# Altium schematic sheet 11_Power.SchDoc: Power (part 1 of 2)
size A3; Organization: Lime Microsystems; Address1: Surrey Tech Centre; Address2: Guildford GU2 7YG; Address3: Surrey; Address4: United Kingdom; Revision: v1.0; SheetNumber: 11; SheetTotal: 11
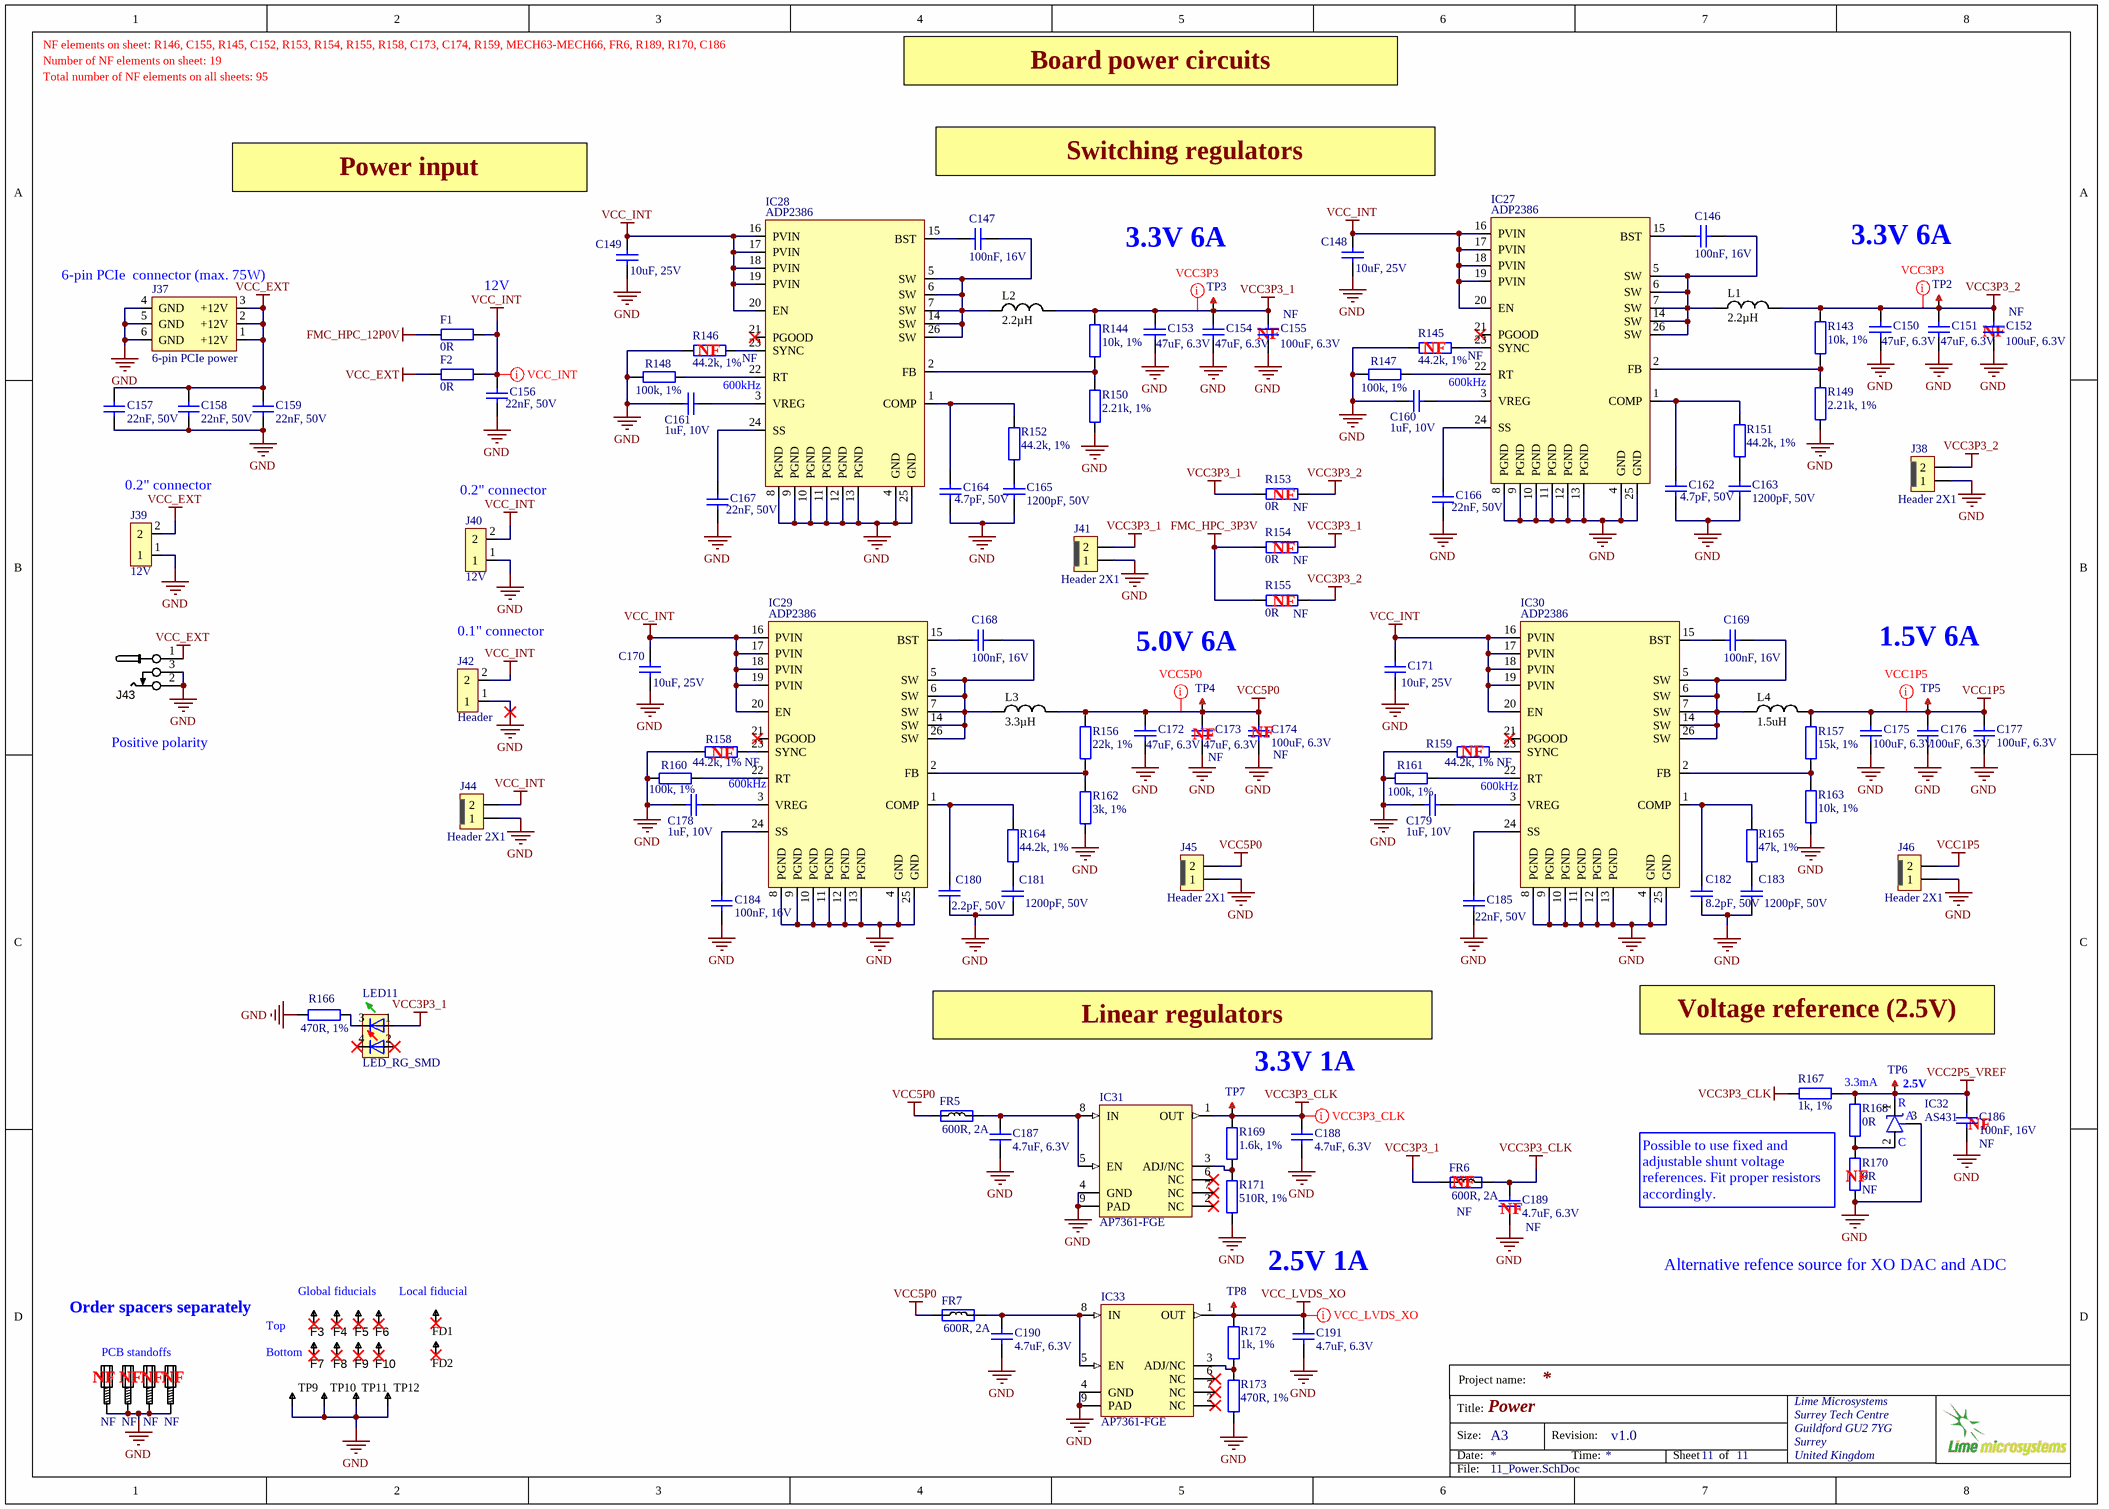
[diagram p0: 11_Power.SchDoc]

## Parts
C146  100nF, 16V  [CAP0402]
C147  100nF, 16V  [CAP0402]
C148  10uF, 25V  [CAP0805]
C149  10uF, 25V  [CAP0805]
C150  47uF, 6.3V  [CAP1206]
C151  47uF, 6.3V  [CAP1206]
C152  100uF, 6.3V  Assembly Info: NF  [CAP1206]
C153  47uF, 6.3V  [CAP1206]
C154  47uF, 6.3V  [CAP1206]
C155  100uF, 6.3V  Assembly Info: NF  [CAP1206]
C156  22nF, 50V  [CAP0402]
C157  22nF, 50V  [CAP0402]
C158  22nF, 50V  [CAP0402]
C159  22nF, 50V  [CAP0402]
C160  1uF, 10V  [CAP0402]
C161  1uF, 10V  [CAP0402]
C162  4.7pF, 50V  [CAP0402]
C163  1200pF, 50V  [CAP0402]
C164  4.7pF, 50V  [CAP0402]
C165  1200pF, 50V  [CAP0402]
C166  22nF, 50V  [CAP0402]
C167  22nF, 50V  [CAP0402]
C168  100nF, 16V  [CAP0402]
C169  100nF, 16V  [CAP0402]
C170  10uF, 25V  [CAP0805]
C171  10uF, 25V  [CAP0805]
C172  47uF, 6.3V  [CAP1206]
C173  47uF, 6.3V  Assembly Info: NF  [CAP1206]
C174  100uF, 6.3V  Assembly Info: NF  [CAP1206]
C175  100uF, 6.3V  [CAP1206]
C176  100uF, 6.3V  [CAP1206]
C177  100uF, 6.3V  [CAP1206]
C178  1uF, 10V  [CAP0402]
C179  1uF, 10V  [CAP0402]
C180  2.2pF, 50V  [CAP0402]
C181  1200pF, 50V  [CAP0402]
C182  8.2pF, 50V  [CAP0402]
C183  1200pF, 50V  [CAP0402]
C184  100nF, 16V  [CAP0402]
C185  22nF, 50V  [CAP0402]
C186  100nF, 16V  Assembly Info: NF  [CAP0402]
C187  4.7uF, 6.3V  [CAP0402]
C188  4.7uF, 6.3V  [CAP0402]
C189  4.7uF, 6.3V  Assembly Info: NF  [CAP0402]
C190  4.7uF, 6.3V  [CAP0402]
C191  4.7uF, 6.3V  [CAP0402]
F1  0R  [RES0805]
F2  0R  [RES0805]
F3  Fiducial  [Fiducial]  (value not drawn)
F4  Fiducial  [Fiducial]  (value not drawn)
F5  Fiducial  [Fiducial]  (value not drawn)
F6  Fiducial  [Fiducial]  (value not drawn)
F7  Fiducial  [Fiducial]  (value not drawn)
F8  Fiducial  [Fiducial]  (value not drawn)
F9  Fiducial  [Fiducial]  (value not drawn)
F10  Fiducial  [Fiducial]  (value not drawn)
FD1  Fiducial  [Fiducial_local]  (value not drawn)
FD2  Fiducial  [Fiducial_local]  (value not drawn)
FR5  600R, 2A  [RES0805]
FR6  600R, 2A  Assembly Info: NF  [RES0805]
FR7  600R, 2A  [RES0805]
IC27  ADP2386  [ADP2386]
IC28  ADP2386  [ADP2386]
IC29  ADP2386  [ADP2386]
IC30  ADP2386  [ADP2386]
IC31  AP7361-FGE  [AP7361]
IC32  AS431  [SOT23-3_v2]
IC33  AP7361-FGE  [AP7361]
J37  6-pin PCIe power  [PCIe_POWER_HEADER_6PIN]
J38  Header 2X1  [Header1x2_TH_LOCKING]
J39  12V  [1744037-2_CONNECTOR_1X2]
J40  12V  [1744037-2_CONNECTOR_1X2]
J41  Header 2X1  [Header1x2_TH_LOCKING]
J42  Header  [HDR_1x2]
J43  CONN_PWR_JACK_2.1x5.5mm  [CONN_PWR_JACK_v2]  (value not drawn)
J44  Header 2X1  [Header1x2_TH_LOCKING]
J45  Header 2X1  [Header1x2_TH_LOCKING]
J46  Header 2X1  [Header1x2_TH_LOCKING]
L1  2.2µH  [FDVE1040_TOKO_INDUCTOR]
L2  2.2µH  [FDVE1040_TOKO_INDUCTOR]
L3  3.3µH  [FDVE1040_TOKO_INDUCTOR]
L4  1.5uH  [FDVE1040_TOKO_INDUCTOR]
LED11  LED_RG_SMD  [LED-2x0603]
MECH63  Assembly Info: NF  [PCB_standoff]  (hidden comment: # pcs.)
MECH64  Assembly Info: NF  [PCB_standoff]  (hidden comment: # pcs.)
MECH65  Assembly Info: NF  [PCB_standoff]  (hidden comment: # pcs.)
MECH66  Assembly Info: NF  [PCB_standoff]  (hidden comment: # pcs.)
R143  10k, 1%  [RES0402]
R144  10k, 1%  [RES0402]
R145  44.2k, 1%  Assembly Info: NF  [RES0402]
R146  44.2k, 1%  Assembly Info: NF  [RES0402]
R147  100k, 1%  [RES0402]
R148  100k, 1%  [RES0402]
R149  2.21k, 1%  [RES0402]
R150  2.21k, 1%  [RES0402]
R151  44.2k, 1%  [RES0402]
R152  44.2k, 1%  [RES0402]
R153  0R  Assembly Info: NF  [RES0805]
R154  0R  Assembly Info: NF  [RES0805]
R155  0R  Assembly Info: NF  [RES0805]
R156  22k, 1%  [RES0402]
R157  15k, 1%  [RES0402]
R158  44.2k, 1%  Assembly Info: NF  [RES0402]
R159  44.2k, 1%  Assembly Info: NF  [RES0402]
R160  100k, 1%  [RES0402]
R161  100k, 1%  [RES0402]
R162  3k, 1%  [RES0402]
R163  10k, 1%  [RES0402]
R164  44.2k, 1%  [RES0402]
R165  47k, 1%  [RES0402]
R166  470R, 1%  [RES0402]
R167  1k, 1%  [RES0402]
R168  0R  [RES0402]
R169  1.6k, 1%  [RES0402]
R170  0R  Assembly Info: NF  [RES0402]
R171  510R, 1%  [RES0402]
R172  1k, 1%  [RES0402]
R173  470R, 1%  [RES0402]
TP2  TESTPOINT_PAD  [TP_PAD_1p5MM]  (value not drawn)  (no BOM)
TP3  TESTPOINT_PAD  [TP_PAD_1p5MM]  (value not drawn)  (no BOM)
TP4  TESTPOINT_PAD  [TP_PAD_1p5MM]  (value not drawn)  (no BOM)
TP5  TESTPOINT_PAD  [TP_PAD_1p5MM]  (value not drawn)  (no BOM)
TP6  TESTPOINT_PAD  [TP_PAD_1p5MM]  (value not drawn)  (no BOM)
TP7  TESTPOINT_PAD  [TP_PAD_1p5MM]  (value not drawn)  (no BOM)
TP8  TESTPOINT_PAD  [TP_PAD_1p5MM]  (value not drawn)  (no BOM)
TP9  TESTPOINT_THT_MINI  [TP-SMD-LOW_PROFILE]  (value not drawn)
TP10  TESTPOINT_THT_MINI  [TP-SMD-LOW_PROFILE]  (value not drawn)
TP11  TESTPOINT_THT_MINI  [TP-SMD-LOW_PROFILE]  (value not drawn)
TP12  TESTPOINT_THT_MINI  [TP-SMD-LOW_PROFILE]  (value not drawn)

## Nets
FMC_HPC_3P3V: R154.2 R155.2
FMC_HPC_12P0V: F1.2
GND: C148.1 C149.1 C150.1 C151.1 C152.1 C153.1 C154.1 C155.1 C156.2 C157.2 C158.2 C159.2 C160.2 C161.2 C162.2 C163.2 C164.2 C165.2 C166.2 C167.2 C170.1 C171.1 C172.1 C173.1 C174.1 C175.1 C176.1 C177.1 C178.2 C179.2 C180.2 C181.2 C182.2 C183.2 C184.1 C185.2 C186.1 C187.1 C188.1 C189.1 C190.1 C191.1 IC27.4(GND) IC27.8(PGND) IC27.9(PGND) IC27.10(PGND) IC27.11(PGND) IC27.12(PGND) IC27.13(PGND) IC27.25(GND) IC28.4(GND) IC28.8(PGND) IC28.9(PGND) IC28.10(PGND) IC28.11(PGND) IC28.12(PGND) IC28.13(PGND) IC28.25(GND) IC29.4(GND) IC29.8(PGND) IC29.9(PGND) IC29.10(PGND) IC29.11(PGND) IC29.12(PGND) IC29.13(PGND) IC29.25(GND) IC30.4(GND) IC30.8(PGND) IC30.9(PGND) IC30.10(PGND) IC30.11(PGND) IC30.12(PGND) IC30.13(PGND) IC30.25(GND) IC31.4(GND) IC31.9(PAD) IC32.3(NC/A) IC33.4(GND) IC33.9(PAD) J37.4(GND) J37.5(GND) J37.6(GND) J38.1 J39.1 J40.1 J41.1 J42.1 J43.2 J43.3 J44.1 J45.1 J46.1 MECH63.MH1 MECH64.MH1 MECH65.MH1 MECH66.MH1 R145.2 R146.2 R147.2 R148.2 R149.1 R150.1 R158.2 R159.2 R160.2 R161.2 R162.1 R163.2 R166.2 R170.2 R171.2 R173.2 TP9.1 TP10.1 TP11.1 TP12.1
VCC1P5: C175.2 C176.2 C177.2 J46.2 L4.2 R157.2 TP5.1
VCC2P5_VREF: C186.2 IC32.1(K) R167.1 R168.1 TP6.1
VCC3P3_1: C153.2 C154.2 C155.2 FR6.1 J41.2 L2.2 LED11.1 R144.1 R153.2 R154.1 TP3.1
VCC3P3_2: C150.2 C151.2 C152.2 J38.2 L1.2 R143.1 R153.1 R155.1 TP2.1
VCC3P3_CLK: C188.2 C189.2 FR6.2 IC31.1(OUT) R167.2 R169.2 TP7.1
VCC5P0: C172.2 C173.2 C174.2 FR5.1 FR7.1 J45.2 L3.2 R156.2 TP4.1
VCC_EXT: C157.1 C158.1 C159.1 F2.2 J37.1(+12V) J37.2(+12V) J37.3(+12V) J39.2 J43.1
VCC_INT: C148.2 C149.2 C156.1 C170.2 C171.2 F1.1 F2.1 IC27.16(PVIN) IC27.17(PVIN) IC27.18(PVIN) IC27.19(PVIN) IC27.20(EN) IC28.16(PVIN) IC28.17(PVIN) IC28.18(PVIN) IC28.19(PVIN) IC28.20(EN) IC29.16(PVIN) IC29.17(PVIN) IC29.18(PVIN) IC29.19(PVIN) IC29.20(EN) IC30.16(PVIN) IC30.17(PVIN) IC30.18(PVIN) IC30.19(PVIN) IC30.20(EN) J40.2 J42.2 J44.2
VCC_LVDS_XO: C191.2 IC33.1(OUT) R172.2 TP8.1
NetC146_1: C146.1 IC27.15(BST)
NetC146_2: C146.2 IC27.5(SW) IC27.6(SW) IC27.7(SW) IC27.14(SW) IC27.26(SW) L1.1
NetC147_1: C147.1 IC28.15(BST)
NetC147_2: C147.2 IC28.5(SW) IC28.6(SW) IC28.7(SW) IC28.14(SW) IC28.26(SW) L2.1
NetC160_1: C160.1 IC27.3(VREG)
NetC161_1: C161.1 IC28.3(VREG)
NetC162_1: C162.1 IC27.1(COMP) R151.2
NetC163_1: C163.1 R151.1
NetC164_1: C164.1 IC28.1(COMP) R152.2
NetC165_1: C165.1 R152.1
NetC166_1: C166.1 IC27.24(SS)
NetC167_1: C167.1 IC28.24(SS)
NetC168_1: C168.1 IC29.15(BST)
NetC168_2: C168.2 IC29.5(SW) IC29.6(SW) IC29.7(SW) IC29.14(SW) IC29.26(SW) L3.1
NetC169_1: C169.1 IC30.15(BST)
NetC169_2: C169.2 IC30.5(SW) IC30.6(SW) IC30.7(SW) IC30.14(SW) IC30.26(SW) L4.1
NetC178_1: C178.1 IC29.3(VREG)
NetC179_1: C179.1 IC30.3(VREG)
NetC180_1: C180.1 IC29.1(COMP) R164.2
NetC181_1: C181.1 R164.1
NetC182_1: C182.1 IC30.1(COMP) R165.2
NetC183_1: C183.1 R165.1
NetC184_2: C184.2 IC29.24(SS)
NetC185_1: C185.1 IC30.24(SS)
NetC187_2: C187.2 FR5.2 IC31.5(EN) IC31.8(IN)
NetC190_2: C190.2 FR7.2 IC33.5(EN) IC33.8(IN)
NetIC27_2: IC27.2(FB) R143.2 R149.2
NetIC27_22: IC27.22(RT) R147.1
NetIC27_23: IC27.23(SYNC) R145.1
NetIC28_2: IC28.2(FB) R144.2 R150.2
NetIC28_22: IC28.22(RT) R148.1
NetIC28_23: IC28.23(SYNC) R146.1
NetIC29_2: IC29.2(FB) R156.1 R162.2
NetIC29_22: IC29.22(RT) R160.1
NetIC29_23: IC29.23(SYNC) R158.1
NetIC30_2: IC30.2(FB) R157.1 R163.1
NetIC30_22: IC30.22(RT) R161.1
NetIC30_23: IC30.23(SYNC) R159.1
NetIC31_3: IC31.3(ADJ/NC) R169.1 R171.1
NetIC32_2: IC32.2(A) R168.2 R170.1
NetIC33_3: IC33.3(ADJ/NC) R172.1 R173.1
NetLED11_3: LED11.3 R166.1

Not connected (* = marked no-connect by the designer): F3 1*; F4 1*; F5 1*; F6 1*; F7 1*; F8 1*; F9 1*; F10 1*; FD1 1*; FD2 1*; IC27 21(PGOOD)*; IC28 21(PGOOD)*; IC29 21(PGOOD)*; IC30 21(PGOOD)*; IC31 2(NC)* 6(NC)* 7(NC)*; IC33 2(NC)* 6(NC)* 7(NC)*; LED11 2* 4*

## Layout directives
net class VCC3P3_CLK: VCC3P3_CLK
net class VCC3P3: VCC3P3_1, VCC3P3_2
net class VCC5P0: VCC5P0
net class VCC1P5: VCC1P5
net class VCC_INT: VCC_INT
net class VCC_LVDS_XO: VCC_LVDS_XO

## Notes on the sheet
- NF elements on sheet: R146, C155, R145, C152, R153, R154, R155, R158, C173, C174, R159, MECH63-MECH66, FR6, R189, R170, C186
- Number of NF elements on sheet: 19
- Total number of NF elements on all sheets: 95
- Board power circuits
- Switching regulators
- Power input
- (near TP3) 3.3V 6A
- (near TP2) 3.3V 6A
- (near J37) 6-pin PCIe  connector (max. 75W)
- (near F1) 12V
- (near R146) NF
- (near C155) NF
- (near R145) NF
- (near C152) NF
- (near IC28) 600kHz
- (near IC27) 600kHz
- 0.2" connector
- (near J40) 0.2" connector
- (near R153) NF
- (near R154) NF
- 0.1" connector
- 5.0V 6A
- (near R155) NF
- (near TP5) 1.5V 6A
- (near J43) Positive polarity
- (near R158) NF
- (near IC29) 600kHz
- (near C173) NF
- (near C174) NF
- (near R159) NF
- (near IC30) 600kHz
- Linear regulators
- Voltage reference (2.5V)
- 3.3V 1A
- 3.3mA
- (near IC32) R
- (near TP6) 2.5V
- (near IC32) A
- (near FR6) NF
- (near R170) NF
- (near IC32) C
- (near C186) NF
- (near C189) NF
- Possible to use fixed and adjustable shunt voltage references. Fit proper resistors accordingly.
- Order spacers separately
- Top
- Global fiducials
- (near FD1) Local fiducial
- 2.5V 1A
- Alternative refence source for XO DAC and ADC
- NF
- PCB standoffs
- (near F7) Bottom
- Project name:
- Title:
- Size:
- Date:
- A3
- Revision:
- Time:
- Sheet
- of
- File: